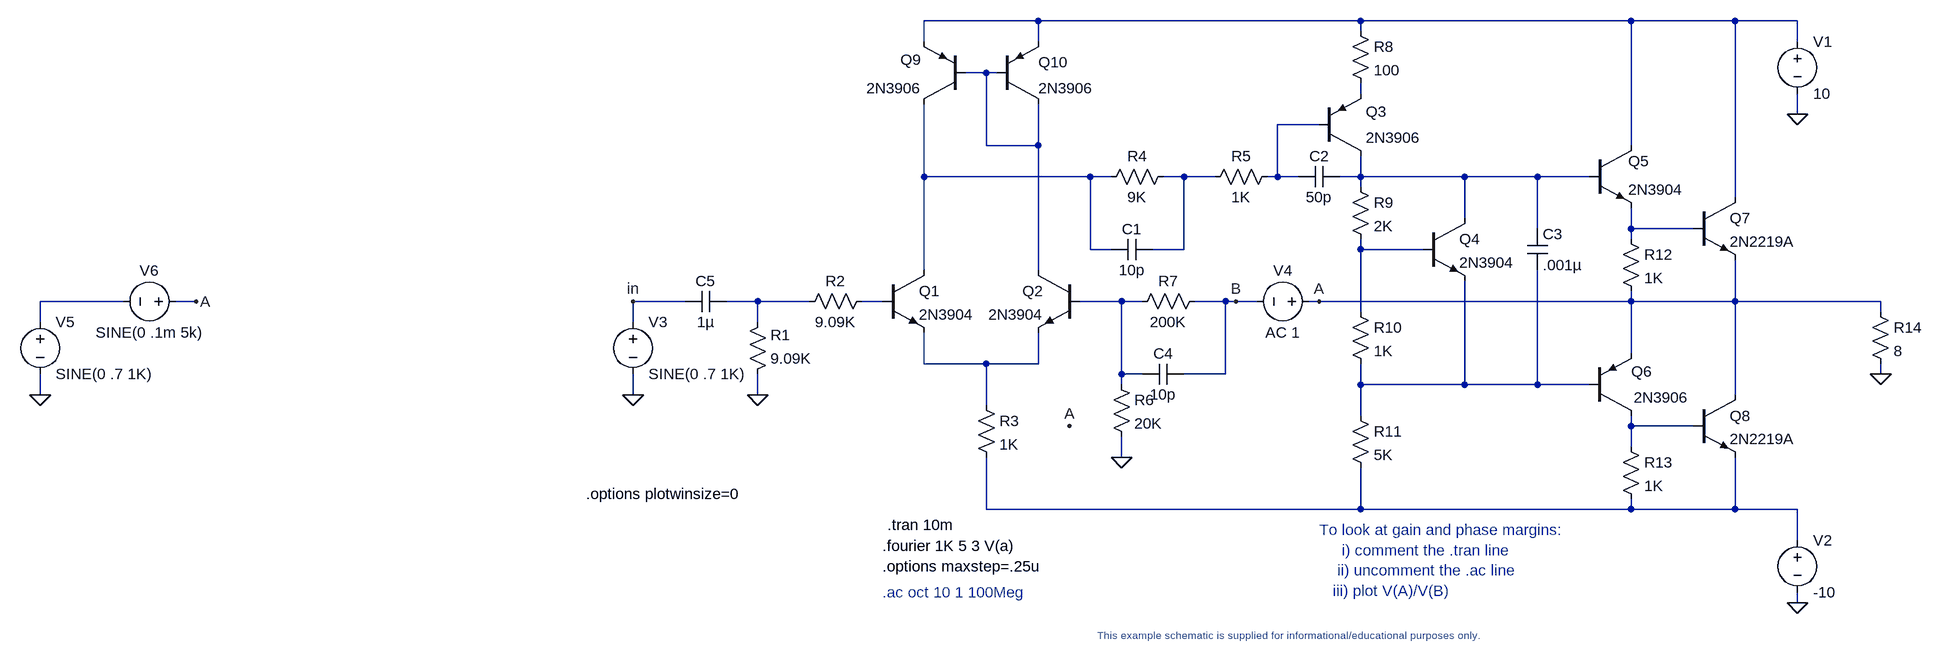
[diagram p0: schematic dotfour.asc]
dotfour.asc, the LTspice schematic file:
Version 4
SHEET 1 2352 1944
WIRE 896 928 720 928
WIRE 1392 928 896 928
WIRE 1808 928 1392 928
WIRE 1968 928 1808 928
WIRE 2064 928 1968 928
WIRE 1392 944 1392 928
WIRE 720 960 720 928
WIRE 896 960 896 928
WIRE 2064 960 2064 928
WIRE 816 1008 784 1008
WIRE 832 1008 816 1008
WIRE 1392 1040 1392 1024
WIRE 2064 1072 2064 1040
WIRE 1328 1088 1264 1088
WIRE 816 1120 816 1008
WIRE 896 1120 896 1056
WIRE 896 1120 816 1120
WIRE 1808 1120 1808 928
WIRE 720 1168 720 1056
WIRE 976 1168 720 1168
WIRE 1008 1168 976 1168
WIRE 1120 1168 1088 1168
WIRE 1168 1168 1120 1168
WIRE 1264 1168 1264 1088
WIRE 1264 1168 1248 1168
WIRE 1296 1168 1264 1168
WIRE 1392 1168 1392 1136
WIRE 1392 1168 1360 1168
WIRE 1552 1168 1392 1168
WIRE 1664 1168 1552 1168
WIRE 1744 1168 1664 1168
WIRE 1392 1184 1392 1168
WIRE 1968 1200 1968 928
WIRE 1552 1232 1552 1168
WIRE 1664 1248 1664 1168
WIRE 1808 1248 1808 1216
WIRE 1904 1248 1808 1248
WIRE 1808 1264 1808 1248
WIRE 976 1280 976 1168
WIRE 1008 1280 976 1280
WIRE 1120 1280 1120 1168
WIRE 1120 1280 1072 1280
WIRE 1392 1280 1392 1264
WIRE 1488 1280 1392 1280
WIRE 720 1312 720 1168
WIRE 896 1312 896 1120
WIRE -512 1360 -640 1360
WIRE -400 1360 -432 1360
WIRE 352 1360 272 1360
WIRE 464 1360 416 1360
WIRE 544 1360 464 1360
WIRE 656 1360 624 1360
WIRE 1024 1360 960 1360
WIRE 1056 1360 1024 1360
WIRE 1184 1360 1136 1360
WIRE 1200 1360 1184 1360
WIRE 1232 1360 1200 1360
WIRE 1328 1360 1312 1360
WIRE 1808 1360 1808 1344
WIRE 1808 1360 1328 1360
WIRE 1968 1360 1968 1296
WIRE 1968 1360 1808 1360
WIRE 2192 1360 1968 1360
WIRE 1392 1376 1392 1280
WIRE 2192 1376 2192 1360
WIRE -640 1392 -640 1360
WIRE 272 1392 272 1360
WIRE 464 1392 464 1360
WIRE 1808 1440 1808 1360
WIRE 720 1456 720 1408
WIRE 816 1456 720 1456
WIRE 896 1456 896 1408
WIRE 896 1456 816 1456
WIRE 1024 1472 1024 1360
WIRE 1056 1472 1024 1472
WIRE 1184 1472 1184 1360
WIRE 1184 1472 1120 1472
WIRE 2192 1472 2192 1456
WIRE 1024 1488 1024 1472
WIRE 1392 1488 1392 1456
WIRE 1552 1488 1552 1328
WIRE 1552 1488 1392 1488
WIRE 1664 1488 1664 1312
WIRE 1664 1488 1552 1488
WIRE 1744 1488 1664 1488
WIRE -640 1504 -640 1472
WIRE 272 1504 272 1472
WIRE 464 1504 464 1472
WIRE 1968 1504 1968 1360
WIRE 816 1520 816 1456
WIRE 1392 1536 1392 1488
WIRE 1808 1552 1808 1536
WIRE 1904 1552 1808 1552
WIRE 1808 1584 1808 1552
WIRE 1024 1600 1024 1568
WIRE 816 1680 816 1600
WIRE 1392 1680 1392 1616
WIRE 1392 1680 816 1680
WIRE 1808 1680 1808 1664
WIRE 1808 1680 1392 1680
WIRE 1968 1680 1968 1600
WIRE 1968 1680 1808 1680
WIRE 2064 1680 1968 1680
WIRE 2064 1728 2064 1680
WIRE 2064 1824 2064 1808
FLAG 2064 1072 0
FLAG 2064 1824 0
FLAG 2192 1472 0
FLAG 272 1504 0
FLAG 1328 1360 A
FLAG 1200 1360 B
FLAG 272 1360 in
FLAG 1024 1600 0
FLAG 464 1504 0
FLAG -640 1504 0
FLAG 944 1552 A
FLAG -400 1360 A
SYMBOL NPN 1744 1120 R0
WINDOW 0 60 24 Left 2
WINDOW 3 60 68 Left 2
SYMATTR InstName Q5
SYMATTR Value 2N3904
SYMBOL npn 1904 1200 R0
SYMATTR InstName Q7
SYMATTR Value 2N2219A
SYMBOL npn 1904 1504 R0
SYMATTR InstName Q8
SYMATTR Value 2N2219A
SYMBOL PNP 1744 1536 M180
WINDOW 0 64 68 Left 2
WINDOW 3 68 28 Left 2
SYMATTR InstName Q6
SYMATTR Value 2N3906
SYMBOL VOLTAGE 2064 944 R0
SYMATTR InstName V1
SYMATTR Value 10
SYMBOL voltage 2064 1712 R0
SYMATTR InstName V2
SYMATTR Value -10
SYMBOL RES 1376 1520 R0
SYMATTR InstName R11
SYMATTR Value 5K
SYMBOL res 2176 1360 R0
SYMATTR InstName R14
SYMATTR Value 8
SYMBOL res 1376 1168 R0
SYMATTR InstName R9
SYMATTR Value 2K
SYMBOL res 1376 1360 R0
SYMATTR InstName R10
SYMATTR Value 1K
SYMBOL npn 1488 1232 R0
SYMATTR InstName Q4
SYMATTR Value 2N3904
SYMBOL npn 656 1312 R0
SYMATTR InstName Q1
SYMATTR Value 2N3904
SYMBOL npn 960 1312 M0
SYMATTR InstName Q2
SYMATTR Value 2N3904
SYMBOL res 800 1504 R0
SYMATTR InstName R3
SYMATTR Value 1K
SYMBOL pnp 1328 1136 M180
WINDOW 0 72 68 Left 2
WINDOW 3 72 28 Left 2
SYMATTR InstName Q3
SYMATTR Value 2N3906
SYMBOL res 1008 1472 R0
SYMATTR InstName R6
SYMATTR Value 20K
SYMBOL res 1152 1344 R90
WINDOW 0 0 56 VBottom 2
WINDOW 3 32 56 VTop 2
SYMATTR InstName R7
SYMATTR Value 200K
SYMBOL voltage 272 1376 R0
SYMATTR InstName V3
SYMATTR Value SINE(0 .7 1K)
SYMBOL res 448 1488 M180
WINDOW 0 36 76 Left 2
WINDOW 3 36 40 Left 2
SYMATTR InstName R1
SYMATTR Value 9.09K
SYMBOL res 1376 928 R0
SYMATTR InstName R8
SYMATTR Value 100
SYMBOL res 1104 1152 R90
WINDOW 0 0 56 VBottom 2
WINDOW 3 32 56 VTop 2
SYMATTR InstName R4
SYMATTR Value 9K
SYMBOL cap 1360 1152 R90
WINDOW 0 0 32 VBottom 2
WINDOW 3 32 32 VTop 2
SYMATTR InstName C2
SYMATTR Value 50p
SYMBOL cap 1072 1264 R90
WINDOW 0 0 32 VBottom 2
WINDOW 3 32 32 VTop 2
SYMATTR InstName C1
SYMATTR Value 10p
SYMBOL res 1792 1568 R0
SYMATTR InstName R13
SYMATTR Value 1K
SYMBOL res 1792 1248 R0
SYMATTR InstName R12
SYMATTR Value 1K
SYMBOL cap 1648 1248 R0
SYMATTR InstName C3
SYMATTR Value .001µ
SYMBOL res 1264 1152 R90
WINDOW 0 0 56 VBottom 2
WINDOW 3 32 56 VTop 2
SYMATTR InstName R5
SYMATTR Value 1K
SYMBOL voltage 1328 1360 R90
WINDOW 0 -32 56 VBottom 2
WINDOW 3 32 56 VTop 2
SYMATTR InstName V4
SYMATTR Value AC 1
SYMBOL pnp 784 1056 R180
WINDOW 0 68 68 Left 2
WINDOW 3 68 24 Left 2
SYMATTR InstName Q9
SYMATTR Value 2N3906
SYMBOL pnp 832 1056 M180
WINDOW 0 64 64 Left 2
WINDOW 3 64 24 Left 2
SYMATTR InstName Q10
SYMATTR Value 2N3906
SYMBOL cap 1120 1456 R90
WINDOW 0 0 32 VBottom 2
WINDOW 3 32 32 VTop 2
SYMATTR InstName C4
SYMATTR Value 10p
SYMBOL res 528 1376 R270
WINDOW 0 32 56 VTop 2
WINDOW 3 0 56 VBottom 2
SYMATTR InstName R2
SYMATTR Value 9.09K
SYMBOL cap 416 1344 R90
WINDOW 0 0 32 VBottom 2
WINDOW 3 32 32 VTop 2
SYMATTR InstName C5
SYMATTR Value 1µ
SYMBOL voltage -640 1376 R0
SYMATTR InstName V5
SYMATTR Value SINE(0 .7 1K)
SYMBOL voltage -416 1360 R90
WINDOW 0 -32 56 VBottom 2
WINDOW 3 32 56 VTop 2
SYMATTR InstName V6
SYMATTR Value SINE(0 .1m 5k)
TEXT 664 1704 Left 2 !.tran 10m
TEXT 656 1768 Left 2 !.options maxstep=.25u
TEXT 656 1808 Left 2 ;.ac oct 10 1 100Meg
TEXT 1328 1712 Left 2 ;To look at gain and phase margins:\n     i) comment the .tran line\n    ii) uncomment the .ac line\n   iii) plot V(A)/V(B)
TEXT 1272 1864 Top 1 ;This example schematic is supplied for informational/educational purposes only.
TEXT 656 1736 Left 2 !.fourier 1K 5 3 V(a)
TEXT 200 1656 Left 2 !.options plotwinsize=0

The netlist it stands for:
* dotfour.asc
Q5 N001 N007 N008 0 2N3904
Q7 N001 N008 A 0 2N2219A
Q8 A N016 N017 0 2N2219A
Q6 N016 N015 A 0 2N3906
V1 N001 0 10
V2 N017 0 -10
R11 N015 N017 5K
R14 A 0 8
R9 N007 N009 2K
R10 N009 N015 1K
Q4 N007 N009 N015 0 2N3904
Q1 N005 N012 N014 0 2N3904
Q2 N002 N013 N014 0 2N3904
R3 N014 N017 1K
Q3 N007 N004 N003 0 2N3906
R6 N013 0 20K
R7 B N013 200K
V3 in 0 SINE(0 .7 1K)
R1 0 N011 9.09K
R8 N001 N003 100
R4 N006 N005 9K
C2 N007 N004 50p
C1 N006 N005 10p
R13 N016 N017 1K
R12 N008 A 1K
C3 N007 N015 .001µ
R5 N004 N006 1K
V4 A B AC 1
Q9 N005 N002 N001 0 2N3906
Q10 N002 N002 N001 0 2N3906
C4 B N013 10p
R2 N011 N012 9.09K
C5 N011 in 1µ
V5 N010 0 SINE(0 .7 1K)
V6 A N010 SINE(0 .1m 5k)
.model NPN NPN
.model PNP PNP
.lib standard.bjt
.tran 10m
.options maxstep=.25u
* .ac oct 10 1 100Meg
* To look at gain and phase margins:
*      i) comment the .tran line
*     ii) uncomment the .ac line
*    iii) plot V(A)/V(B)
* This example schematic is supplied for informational/educational purposes only.
.fourier 1K 5 3 V(a)
.options plotwinsize=0
.backanno
.end